# EAGLE design Application (EAGLE 7.5.0)
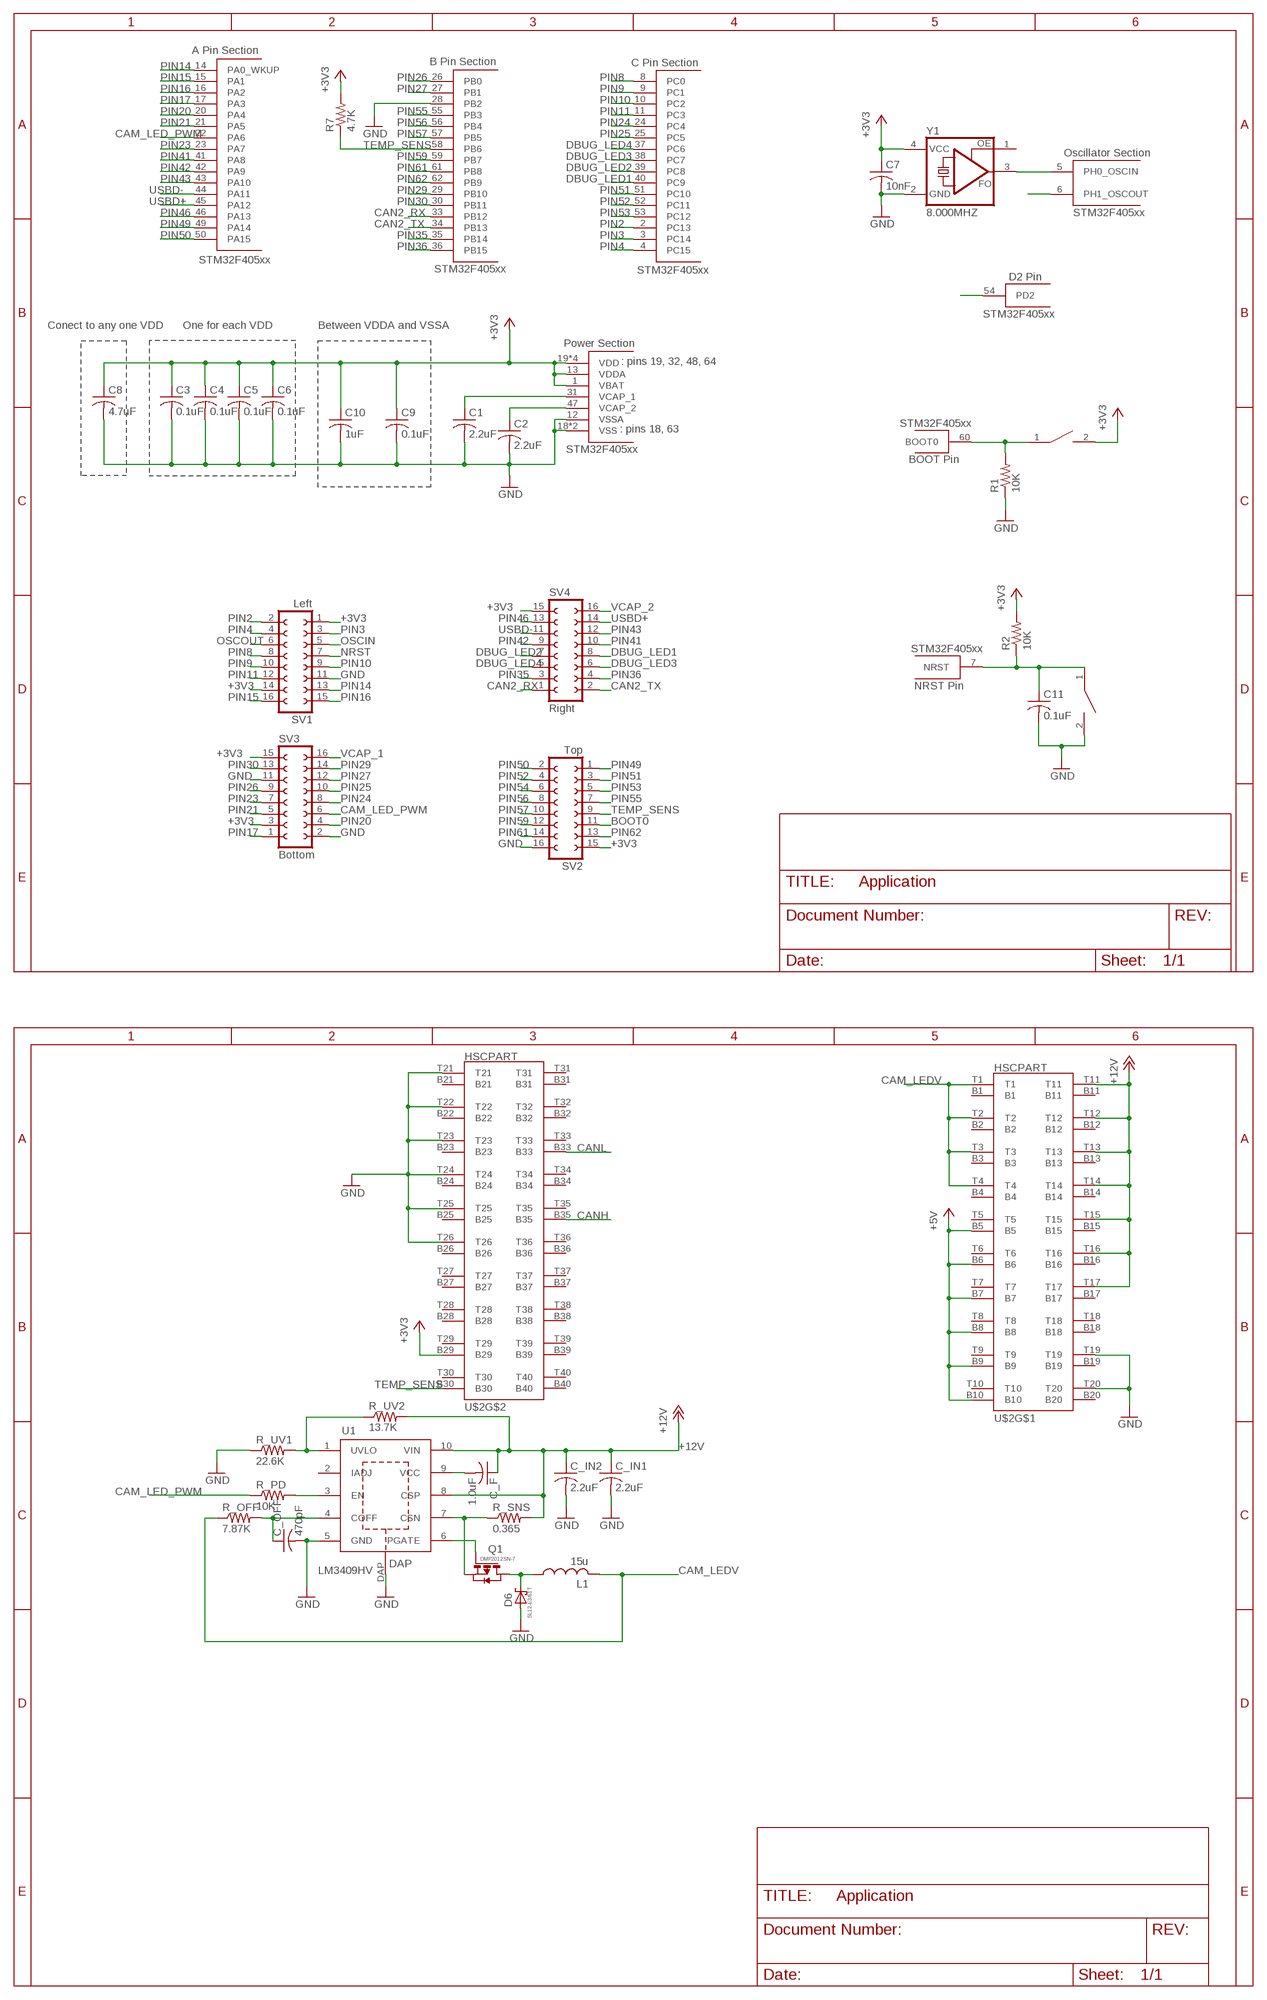
[diagram p0: schematic, sheet 1, part 1 of 2]
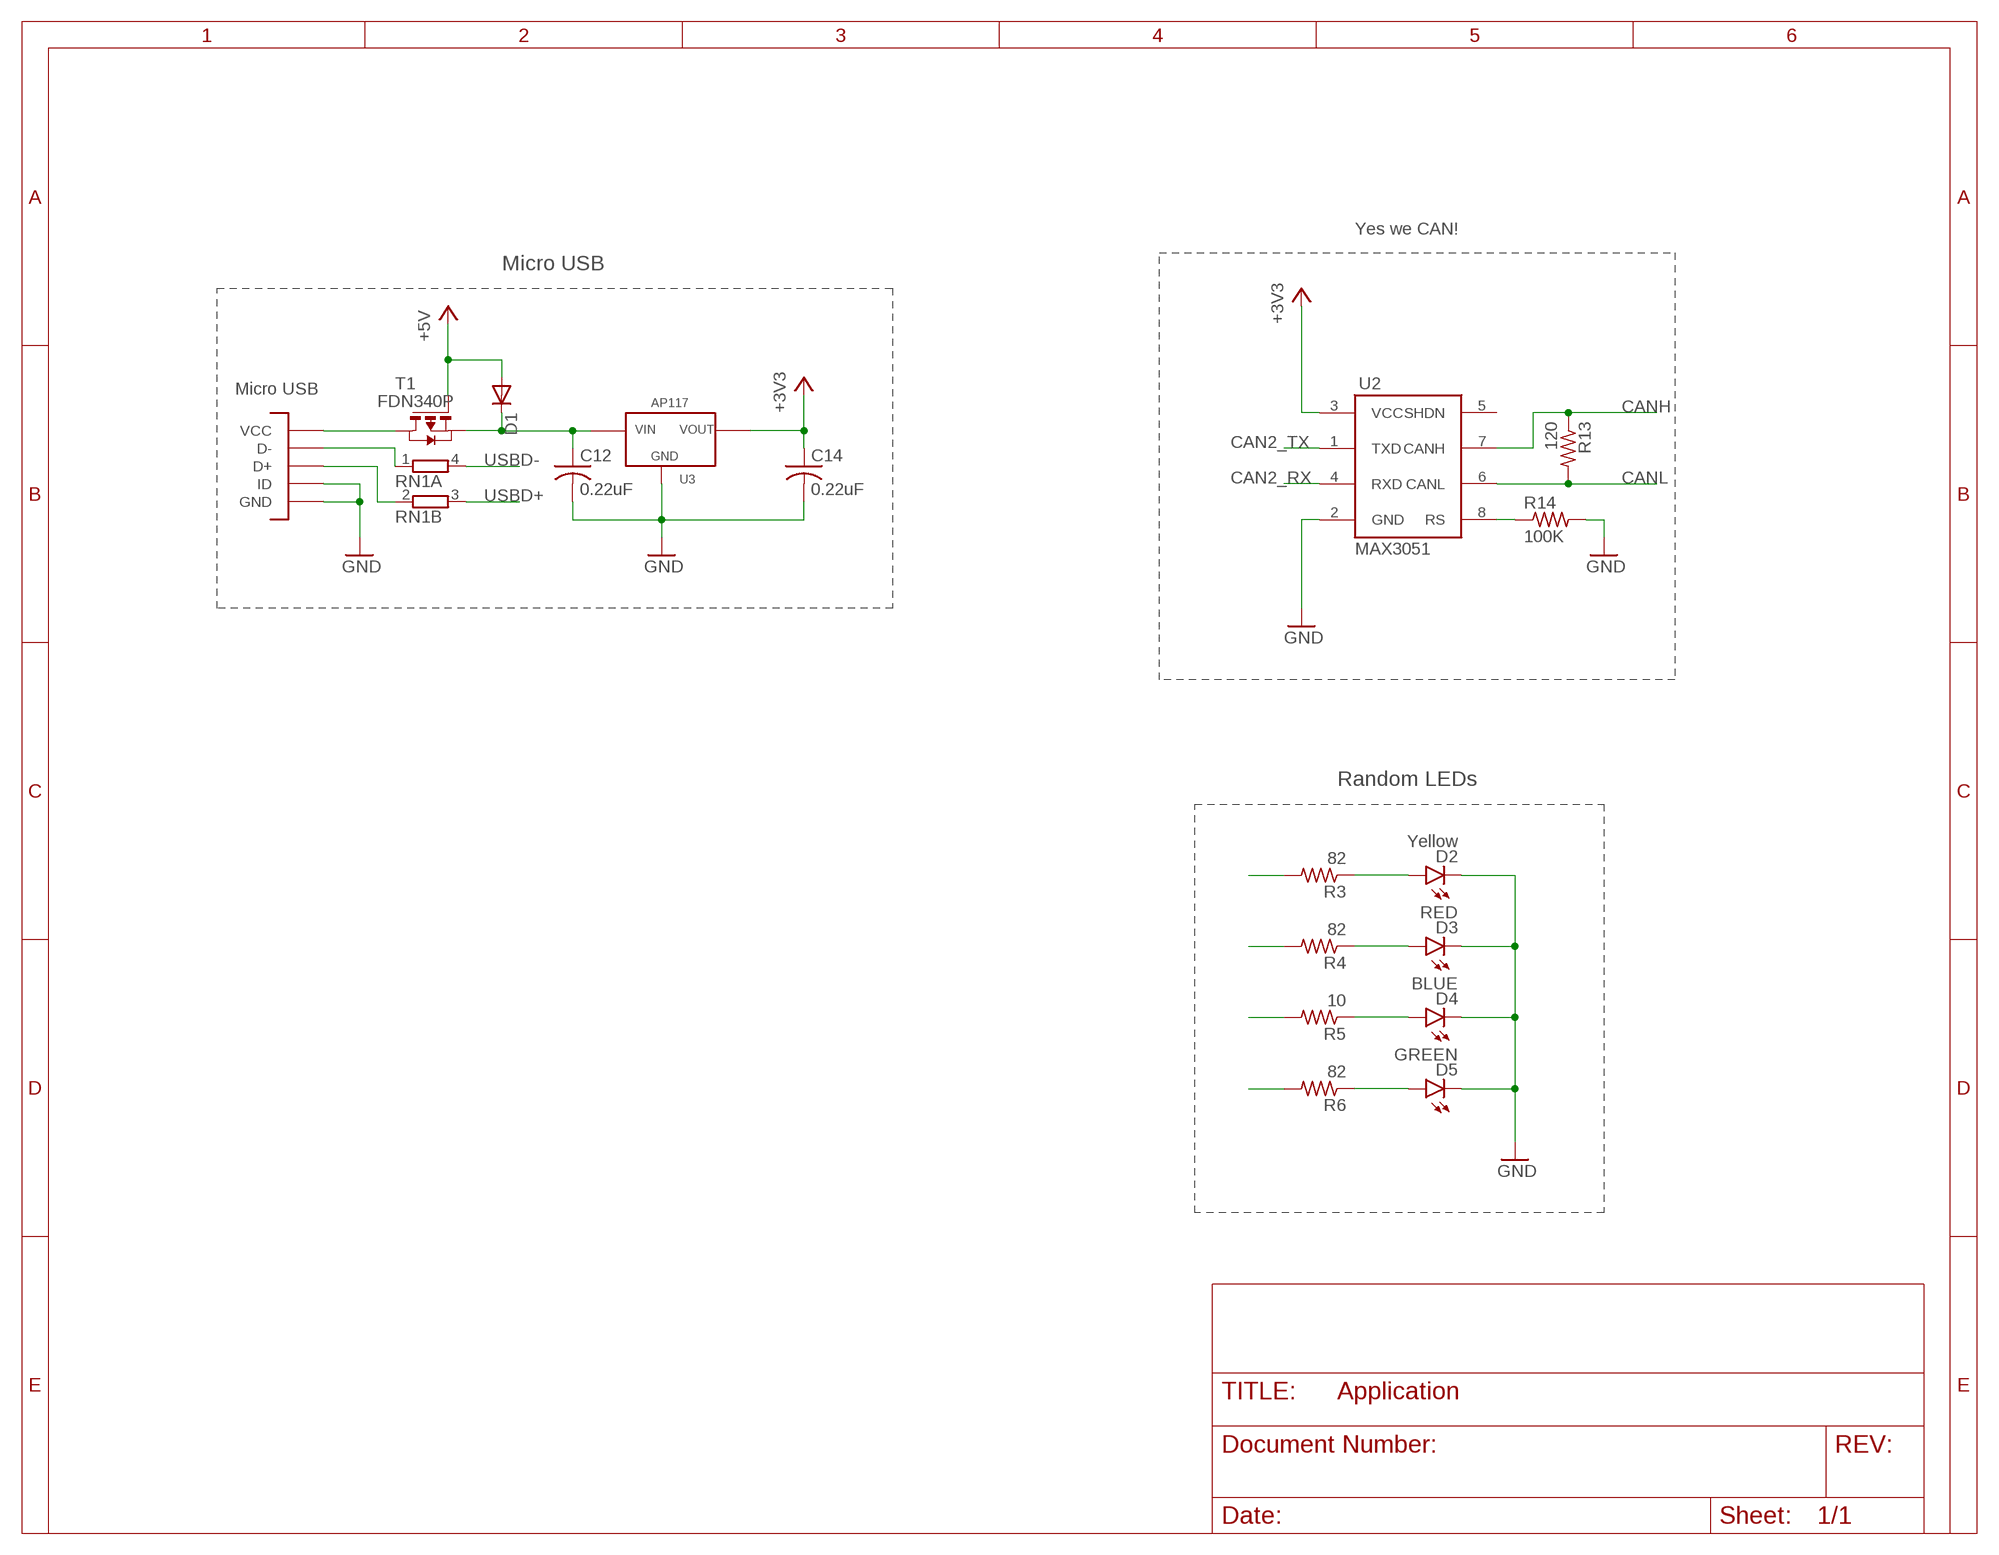
[diagram p1: schematic, sheet 1, part 2 of 2]

## Parts
C1  2.2uF  C-USC0603  [C0603]
C2  2.2uF  C-USC0603  [C0603]
C3  0.1uF  C-USC0603  [C0603]
C4  0.1uF  C-USC0603  [C0603]
C5  0.1uF  C-USC0603  [C0603]
C6  0.1uF  C-USC0603  [C0603]
C7  10nF  C-USC0603  [C0603]
C8  4.7uF  C-USC0603  [C0603]
C9  0.1uF  C-USC0603  [C0603]
C10  1uF  C-USC0603  [C0603]
C11  0.1uF  C-USC0603  [C0603]
C12  0.22uF  C-USC0603  [C0603]
C14  0.22uF  C-USC0603  [C0603]
C_F  1.0uF  C-USC0603  [C0603]
C_IN1  2.2uF  C-USC0603  [C0603]
C_IN2  2.2uF  C-USC0603  [C0603]
C_OFF  470pF  C-USC0603  [C0603]
D1  DIODE-DO-214AC  [DO-214AC]
D2  Yellow  LED-YELLOW0603  [LED-0603]
D3  RED  LED-RED0603  [LED-0603]
D4  BLUE  LED-BLUE0603  [LED-0603]
D5  GREEN  LED-GREEN0603  [LED-0603]
D6  SL12-E3/61T  [SL12-E3/61T]
L1  15u  SRN8040  [SRN8040]
Q1  DMP2012SN-7  [DMP2012SN-7]
R1  10K  R-US_R0603  [R0603]
R2  10K  R-US_R0603  [R0603]
R3  82  R-US_R0603  [R0603]
R4  82  R-US_R0603  [R0603]
R5  10  R-US_R0603  [R0603]
R6  82  R-US_R0603  [R0603]
R7  4.7K  R-US_R0603  [R0603]
R13  120  R-US_R0603  [R0603]
R14  100K  R-US_R0603  [R0603]
R_OFF  7.87K  R-US_R0603  [R0603]
R_PD  10K  R-US_R0603  [R0603]
R_SNS  0.365  R-US_R2512  [R2512]
R_UV1  22.6K  R-US_R0603  [R0603]
R_UV2  13.7K  R-US_R0603  [R0603]
RN1  2R-NEXBV4V  [EXBV4V]
S1  BOOT  SWITCH  [SW_2512]
S2  RESET  SWITCH  [SW_2512]
SV1  Left  FE08-2  [FE08-2]
SV2  Top  FE08-2  [FE08-2]
SV3  Bottom  FE08-2  [FE08-2]
SV4  Right  FE08-2  [FE08-2]
T1  FDN340P  [SOT-23]
U1  LM3409HV  LM3409HV'LM3409HV'  [VSSOP-10]
U2  MAX3051  MAX3051MAX3051  [SOT23-8L]
U3  U3  AP1117_LIN_REG  [SOT223]
U$1  STM32F405  [LQFP64]
U$2  HSCPART  [HSC8-40PINOUUT]
U$4  MICROUSB  [MICRO_B]
Y1  8.000MHZ  ASF  [ASF]

## Nets
+3V3: C3.1 C4.1 C5.1 C6.1 C7.1 C8.1 C9.1 C10.1 C14.1 R2.2 R7.2 S1.2 SV1.1 SV1.14 SV2.15 SV3.3 SV3.15 SV4.15 U2.3(VCC) U3.TAB(VOUT) U3.VOUT U$1.1(VBAT) U$1.13(VDDA) U$1.19(VDD) U$1.32(VDD) U$1.48(VDD) U$1.64(VDD) U$2.B29 Y1.4(VCC)
+5V: D1.A T1.3(G) U$2.B5 U$2.B6 U$2.B7 U$2.B8 U$2.B9 U$2.B10
+12V: C_F.1 C_IN1.1 C_IN2.1 R_SNS.2 R_UV2.2 U1.8(CSP) U1.10(VIN) U$2.T11 U$2.T12 U$2.T13 U$2.T14 U$2.T15 U$2.T16 U$2.T17
BOOT0: R1.2 S1.1 SV2.11 U$1.60(BOOT0)
CAM_LED_PWM: R_PD.1 SV3.6 U$1.22(PA6)
CAM_LEDV: L1.2 R_OFF.1 U$2.T1 U$2.T2 U$2.T3 U$2.T4
CAN2_RX: SV4.1 U2.4(RXD) U$1.33(PB12)
CAN2_TX: SV4.2 U2.1(TXD) U$1.34(PB13)
CANH: R13.1 U2.7(CANH) U$2.B35
CANL: R13.2 U2.6(CANL) U$2.B33
DBUG_LED1: R3.2 SV4.8 U$1.40(PC9)
DBUG_LED2: R4.2 SV4.7 U$1.39(PC8)
DBUG_LED3: R5.2 SV4.6 U$1.38(PC7)
DBUG_LED4: R6.2 SV4.5 U$1.37(PC6)
GND: C1.2 C2.2 C3.2 C4.2 C5.2 C6.2 C7.2 C8.2 C9.2 C10.2 C11.2 C12.2 C14.2 C_IN1.2 C_IN2.2 C_OFF.2 D2.C D3.C D4.C D5.C D6.2(A) R1.1 R14.2 R_UV1.1 S2.2 SV1.11 SV2.16 SV3.2 SV3.11 U1.5(GND) U1.DAP U2.2(GND) U3.GND U$1.12(VSSA) U$1.18(VSS) U$1.28(PB2) U$1.63(VSS) U$2.T19 U$2.T20 U$2.T21 U$2.T22 U$2.T23 U$2.T24 U$2.T25 U$2.T26 U$4.GND1(GND) U$4.GND2(GND) U$4.GND3(GND) U$4.GND4(GND) U$4.GND7(GND) U$4.GND8(GND) U$4.P4(ID) U$4.P5(GND) Y1.2(GND)
L1: D6.1(C) L1.1 Q1.1(D)
N$1: RN1.1 U$4.P2(D-)
N$5: R_UV1.2 R_UV2.1 U1.1(UVLO)
N$6: C_OFF.1 R_OFF.2 U1.4(COFF)
N$7: C_F.2 U1.9(VCC)
N$8: Q1.3(S) R_SNS.1 U1.7(CSN)
N$9: R_PD.2 U1.3(EN)
N$10: Q1.2(G) U1.6(PGATE)
N$24: RN1.2 U$4.P3(D+)
N$57: T1.1(D) U$4.P1(VCC)
N$58: C12.1 D1.C T1.2(S) U3.VIN
N$59: D2.A R3.1
N$60: D3.A R4.1
N$61: D4.A R5.1
N$62: D5.A R6.1
N$63: R14.1 U2.8(RS)
NRST: C11.1 R2.1 S2.1 SV1.7 U$1.7(NRST)
OSCIN: SV1.5 U$1.5(PH0_OSCIN) Y1.3(FO)
OSCOUT: SV1.6 U$1.6(PH1_OSCOUT)
PIN2: SV1.2 U$1.2(PC13)
PIN3: SV1.3 U$1.3(PC14)
PIN4: SV1.4 U$1.4(PC15)
PIN8: SV1.8 U$1.8(PC0)
PIN9: SV1.10 U$1.9(PC1)
PIN10: SV1.9 U$1.10(PC2)
PIN11: SV1.12 U$1.11(PC3)
PIN14: SV1.13 U$1.14(PA0_WKUP)
PIN15: SV1.16 U$1.15(PA1)
PIN16: SV1.15 U$1.16(PA2)
PIN17: SV3.1 U$1.17(PA3)
PIN20: SV3.4 U$1.20(PA4)
PIN21: SV3.5 U$1.21(PA5)
PIN23: SV3.7 U$1.23(PA7)
PIN24: SV3.8 U$1.24(PC4)
PIN25: SV3.10 U$1.25(PC5)
PIN26: SV3.9 U$1.26(PB0)
PIN27: SV3.12 U$1.27(PB1)
PIN29: SV3.14 U$1.29(PB10)
PIN30: SV3.13 U$1.30(PB11)
PIN35: SV4.3 U$1.35(PB14)
PIN36: SV4.4 U$1.36(PB15)
PIN41: SV4.10 U$1.41(PA8)
PIN42: SV4.9 U$1.42(PA9)
PIN43: SV4.12 U$1.43(PA10)
PIN46: SV4.13 U$1.46(PA13)
PIN49: SV2.1 U$1.49(PA14)
PIN50: SV2.2 U$1.50(PA15)
PIN51: SV2.3 U$1.51(PC10)
PIN52: SV2.4 U$1.52(PC11)
PIN53: SV2.5 U$1.53(PC12)
PIN54: SV2.6 U$1.54(PD2)
PIN55: SV2.7 U$1.55(PB3)
PIN56: SV2.8 U$1.56(PB4)
PIN57: SV2.10 U$1.57(PB5)
PIN59: SV2.12 U$1.59(PB7)
PIN61: SV2.14 U$1.61(PB8)
PIN62: SV2.13 U$1.62(PB9)
TEMP_SENS: R7.1 SV2.9 U$1.58(PB6) U$2.B30
USBD+: RN1.3 SV4.14 U$1.45(PA12)
USBD-: RN1.4 SV4.11 U$1.44(PA11)
VCAP_1: C1.1 SV3.16 U$1.31(VCAP_1)
VCAP_2: C2.1 SV4.16 U$1.47(VCAP_2)
Unconnected: U1.2(IADJ) U2.5(SHDN) U$2.B1 U$2.B2 U$2.B3 U$2.B4 U$2.B11 U$2.B12 U$2.B13 U$2.B14 U$2.B15 U$2.B16 U$2.B17 U$2.B18 U$2.B19 U$2.B20 U$2.B21 U$2.B22 U$2.B23 U$2.B24 U$2.B25 U$2.B26 U$2.B27 U$2.B28 U$2.B31 U$2.B32 U$2.B34 U$2.B36 U$2.B37 U$2.B38 U$2.B39 U$2.B40 U$2.T5 U$2.T6 U$2.T7 U$2.T8 U$2.T9 U$2.T10 U$2.T18 U$2.T27 U$2.T28 U$2.T29 U$2.T30 U$2.T31 U$2.T32 U$2.T33 U$2.T34 U$2.T35 U$2.T36 U$2.T37 U$2.T38 U$2.T39 U$2.T40 Y1.1(OE)

## Notes on the sheet
- Yes we CAN!
- Micro USB
- Micro USB
- Conect to any one VDD | One for each VDD | Between VDDA and VSSA
- : pins 19, 32, 48, 64
- : pins 18, 63
- Random LEDs

## Library data of the parts
C1-C12 C14 = rcl:C-US: CAPACITOR, American symbol
C_F C_IN1 C_IN2 C_OFF = resistor:C-US: CAPACITOR, American symbol
D1 = DiscreteComponents:DIODE-: DIODE
D2 = SparkFun-LED:LED-YELLOW: Yellow SMD LEDs LilyPad 1206- DIO-09909 0603- DIO-09003 "SMART" means more efficient and expensive; PROD_ID: DIO-09003
D3 = SparkFun-LED:LED-RED: Assorted Red LEDs LilyPad 1206- DIO-09912 1206- DIO-00809 0603- DIO-00819 "SMART" means more efficient and expensive; PROD_ID: DIO-00819
D4 = SparkFun-LED:LED-BLUE: Blue LEDs for production use Various blue LEDs stocked by SparkFun production 0603 - DIO-08575 Rebel - DIO-09553 1206 - DIO-09911; PROD_ID: DIO-08575
D5 = SparkFun-LED:LED-GREEN: Various green LEDs Green LEDs used in SFE Production 0603- DIO-00821 LARGE- DIO-00862 LILYPAD- DIO-09910; PROD_ID: DIO-00821
D6 = DiscreteComponents:SL12-E3/61T
L1 = DiscreteComponents:SRN8040
Q1 = DiscreteComponents:DMP2012SN-7
R1-R7 R13 R14 = rcl:R-US_: RESISTOR, American symbol
R_OFF R_PD R_SNS R_UV1 R_UV2 = DiscreteComponents:R-US_: RESISTOR, American symbol
RN1 = DiscreteComponents:2R-N: Array Chip Resistor; DIGIKEY: RHM1381CT-ND; MF: Rohm Semiconductor; MPN: MNR12ERAPJ220
S1 S2 = DiscreteComponents:SWITCH
SV1-SV4 = con-lsta:FE08-2: FEMALE HEADER; OC_FARNELL: unknown; OC_NEWARK: unknown
T1 = DiscreteComponents:FDN340P: MOS FET; DIGIKEY: FDN340PCT-ND
U1 = 2015_LED_Driver:LM3409HV
U2 = MAX3051 Library:MAX3051: Maxim Integrated MAX3051 CAN Tranciever
U3 = PowerComponents:AP1117_LIN_REG
U$1 = Other:STM32F405
U$2 = Connectors:HSCPART
U$4 = Other:MICROUSB
Y1 = DiscreteComponents:ASF*: CRYSTAL CLOCK OSCILLATORS 5.0 Vdc or 3.3 Vdc - LOW PROFILE ULTRA MINIATURE CERAMIC SURFACE MOUNT Source: http://www.abracon.com/Oscillators/asf1-L-L1.pdf; DIGIKEY: 535-10066-1-ND

## Board
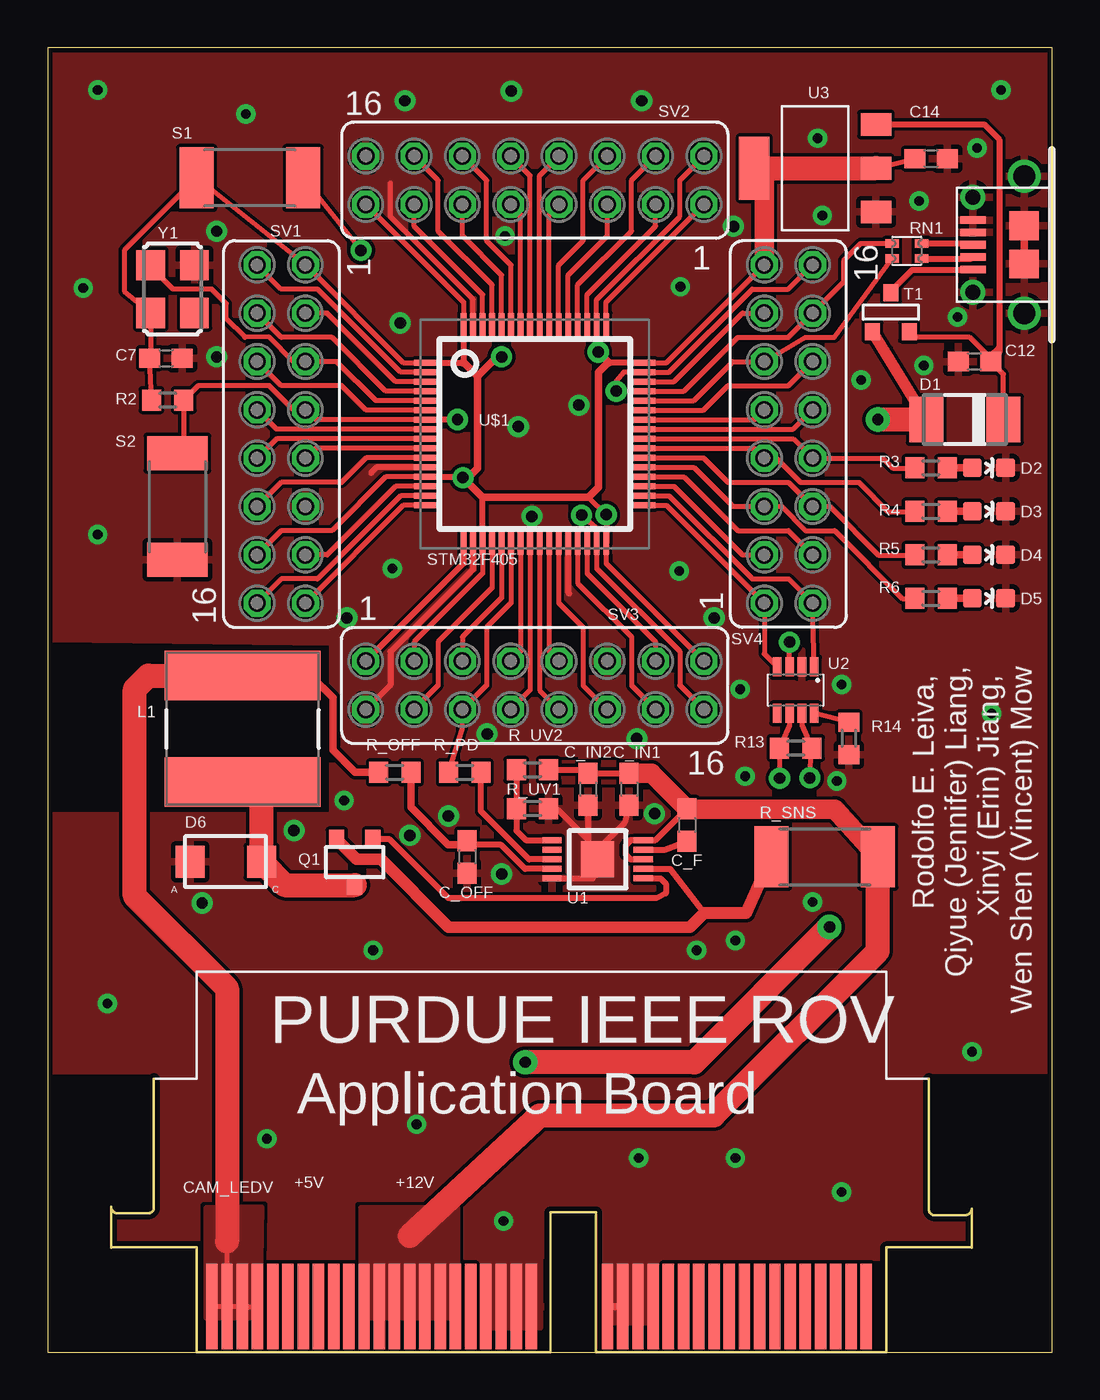
[diagram p2: board, top side]
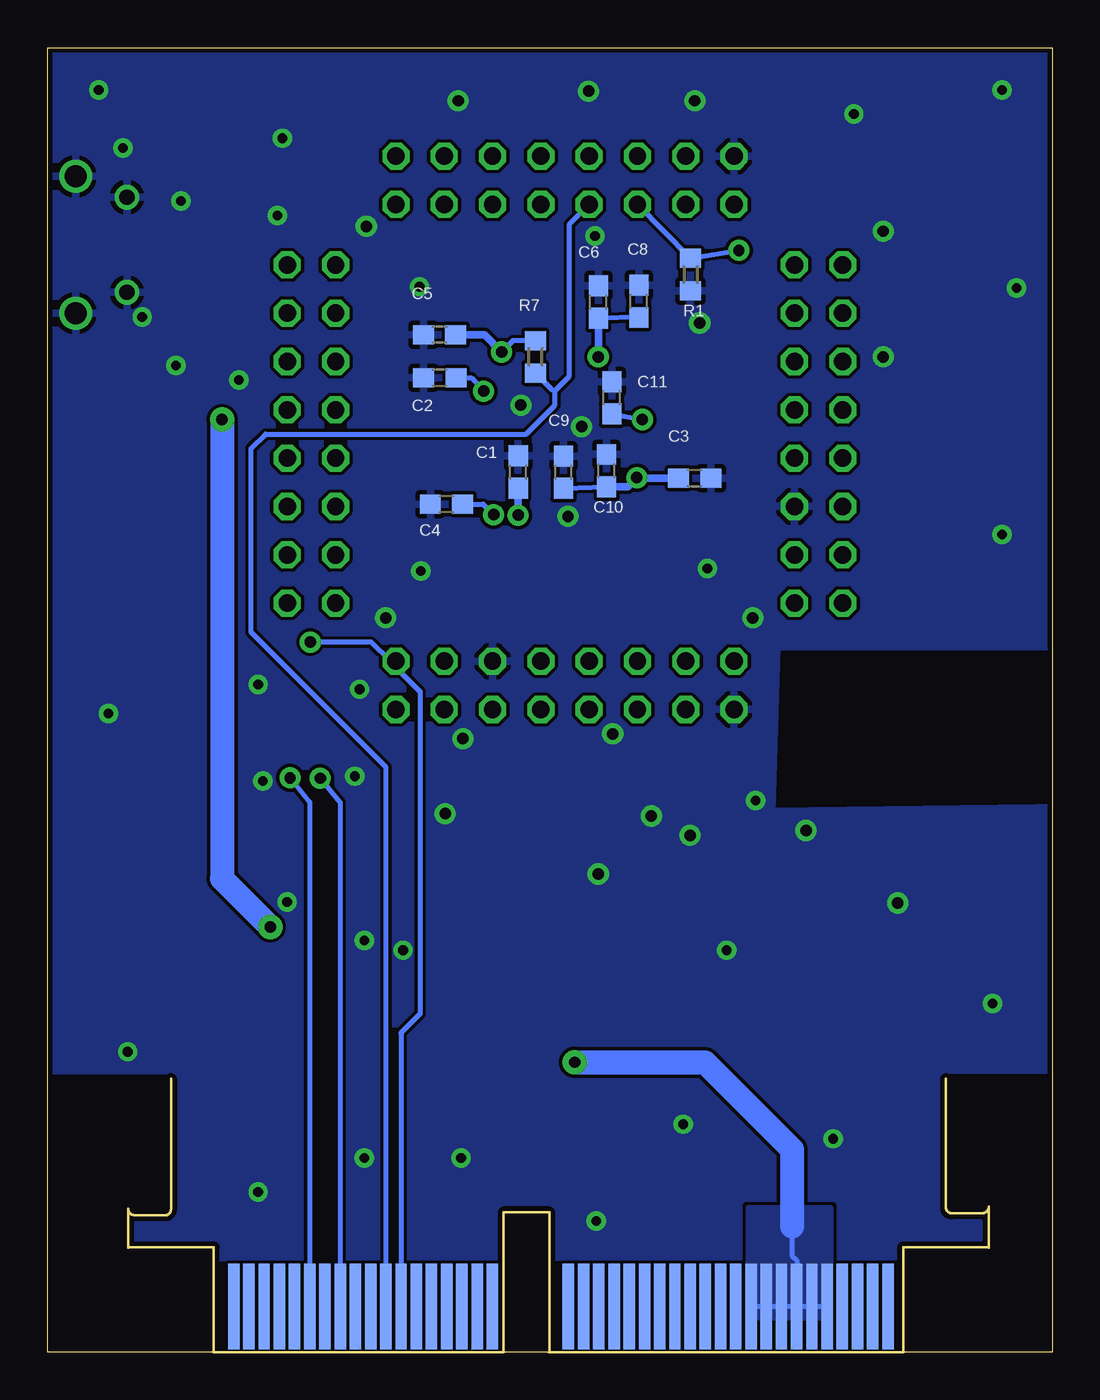
[diagram p3: board, bottom side, seen from below]

Size 52.83 x 68.58 mm. Coordinates in mm from the lower left corner, seen from the top.
Outline: 0,0 52.83,0 52.83,68.58 0,68.58 0,0
Copper layers (1*16): Top 0.035mm / dielectric 1.5mm / Bottom 0.035mm
Design rules "GoldPhoenix": minimum track width 7mil, minimum drill 10mil, track to track 7mil, track to pad 7mil, pad to pad 7mil, via to via 7mil, smd to smd 7mil, copper to edge 10mil, drill to drill 8mil, minimum pad ring 10mil, minimum via ring 10mil, stop-mask expansion 4mil, vias tented up to drill 25mil, thermal gap 10mil

### Footprints (pad centres in the part's own frame; a part is rotated, then mirrored left to right if it is on the bottom)
C0603 = smd 1.1 x 1: 1 -0.85,0; 2 0.85,0
DO-214AC = smd 1.8 x 2.4: A 2.025,0; C -2.025,0
LED-0603 = smd 1 x 1: A 0,-0.877; C 0,0.877
SL12-E3/61T = smd 1.524 x 1.676: 1 -1.88,0; 2 1.88,0
SRN8040 = smd 2.6 x 8.2: 1 -2.8,0; 2 2.8,0
DMP2012SN-7 = smd 0.8 x 1: 1 0,1.2; 2 -0.95,-1.2; 3 0.95,-1.2
R0603 = smd 1 x 1.1: 1 -0.85,0; 2 0.85,0
R2512 = smd 1.8 x 3.2: 1 -2.8,0; 2 2.8,0
EXBV4V = smd 0.45 x 0.7: 1 -0.4,-0.775; 2 0.4,-0.775; 3 0.4,0.775; 4 -0.4,0.775
SW_2512 = smd 1.8 x 3.2: 1 -2.8,0; 2 2.8,0
FE08-2 = drill 0.914 octagon: 1 -8.89,1.27; 2 -8.89,-1.27; 3 -6.35,1.27; 4 -6.35,-1.27; 5 -3.81,1.27; 6 -3.81,-1.27; 7 -1.27,1.27; 8 -1.27,-1.27; 9 1.27,1.27; 10 1.27,-1.27; 11 3.81,1.27; 12 3.81,-1.27; 13 6.35,1.27; 14 6.35,-1.27; 15 8.89,1.27; 16 8.89,-1.27
SOT-23 = smd 0.787 x 0.889: 1 0.025,-1.016; 2 -0.94,1.016; 3 0.991,1.016
VSSOP-10 = smd 0.305 x 1.016: 1 -1.001,-2.4; 2 -0.5,-2.4; 3 0,-2.4; 4 0.5,-2.4; 5 1.001,-2.4; 6 1.001,2.4; 7 0.5,2.4; 8 0,2.4; 9 -0.5,2.4; 10 -1.001,2.4 | smd 1.905 x 1.727: DAP 0,0
SOT23-8L = smd 0.45 x 1: 1 -0.975,-1.225; 2 -0.325,-1.225; 3 0.325,-1.225; 4 0.975,-1.225; 5 0.975,1.225; 6 0.325,1.225; 7 -0.325,1.225; 8 -0.975,1.225
SOT223 = smd 1.2 x 1.6: GND -2.3,-3.2; VIN 2.3,-3.2; VOUT 0,-3.2 | smd 3.3 x 1.6: TAB 0,3.2
LQFP64 = smd 1.2 x 0.3: 1 -5.75,3.75; 2 -5.75,3.25; 3 -5.75,2.75; 4 -5.75,2.25; 5 -5.75,1.75; 6 -5.75,1.25; 7 -5.75,0.75; 8 -5.75,0.25; 9 -5.75,-0.25; 10 -5.75,-0.75; 11 -5.75,-1.25; 12 -5.75,-1.75; 13 -5.75,-2.25; 14 -5.75,-2.75; 15 -5.75,-3.25; 16 -5.75,-3.75; 33 5.75,-3.75; 34 5.75,-3.25; 35 5.75,-2.75; 36 5.75,-2.25; 37 5.75,-1.75; 38 5.75,-1.25; 39 5.75,-0.75; 40 5.75,-0.25; 41 5.75,0.25; 42 5.75,0.75; 43 5.75,1.25; 44 5.75,1.75; 45 5.75,2.25; 46 5.75,2.75; 47 5.75,3.25; 48 5.75,3.75 | smd 0.3 x 1.2: 17 -3.75,-5.75; 18 -3.25,-5.75; 19 -2.75,-5.75; 20 -2.25,-5.75; 21 -1.75,-5.75; 22 -1.25,-5.75; 23 -0.75,-5.75; 24 -0.25,-5.75; 25 0.25,-5.75; 26 0.75,-5.75; 27 1.25,-5.75; 28 1.75,-5.75; 29 2.25,-5.75; 30 2.75,-5.75; 31 3.25,-5.75; 32 3.75,-5.75; 49 3.75,5.75; 50 3.25,5.75; 51 2.75,5.75; 52 2.25,5.75; 53 1.75,5.75; 54 1.25,5.75; 55 0.75,5.75; 56 0.25,5.75; 57 -0.25,5.75; 58 -0.75,5.75; 59 -1.25,5.75; 60 -1.75,5.75; 61 -2.25,5.75; 62 -2.75,5.75; 63 -3.25,5.75; 64 -3.75,5.75
HSC8-40PINOUUT = smd 0.6 x 4.5 bottom: B1 0.8,2.4; B2 1.6,2.4; B3 2.4,2.4; B4 3.2,2.4; B5 4,2.4; B6 4.8,2.4; B7 5.6,2.4; B8 6.4,2.4; B9 7.2,2.4; B10 8,2.4; B11 8.8,2.4; B12 9.6,2.4; B13 10.4,2.4; B14 11.2,2.4; B15 12,2.4; B16 12.8,2.4; B17 13.6,2.4; B18 14.4,2.4; B19 15.2,2.4; B20 16,2.4; B21 16.8,2.4; B22 17.6,2.4; B23 21.6,2.4; B24 22.4,2.4; B25 23.2,2.4; B26 24,2.4; B27 24.8,2.4; B28 25.6,2.4; B29 26.4,2.4; B30 27.2,2.4; B31 28,2.4; B32 28.8,2.4; B33 29.6,2.4; B34 30.4,2.4; B35 31.2,2.4; B36 32,2.4; B37 32.8,2.4; B38 33.6,2.4; B39 34.4,2.4; B40 35.2,2.4 | smd 0.6 x 4.5: T1 0.8,2.4; T2 1.6,2.4; T3 2.4,2.4; T4 3.2,2.4; T5 4,2.4; T6 4.8,2.4; T7 5.6,2.4; T8 6.4,2.4; T9 7.2,2.4; T10 8,2.4; T11 8.8,2.4; T12 9.6,2.4; T13 10.4,2.4; T14 11.2,2.4; T15 12,2.4; T16 12.8,2.4; T17 13.6,2.4; T18 14.4,2.4; T19 15.2,2.4; T20 16,2.4; T21 16.8,2.4; T22 17.6,2.4; T23 21.6,2.4; T24 22.4,2.4; T25 23.2,2.4; T26 24,2.4; T27 24.8,2.4; T28 25.6,2.4; T29 26.4,2.4; T30 27.2,2.4; T31 28,2.4; T32 28.8,2.4; T33 29.6,2.4; T34 30.4,2.4; T35 31.2,2.4; T36 32,2.4; T37 32.8,2.4; T38 33.6,2.4; T39 34.4,2.4; T40 35.2,2.4
MICRO_B = smd 1.5 x 1.55: GND1 -1,1.45; GND2 1,1.45 | drill 0.8: GND3 -2.5,4.15; GND4 2.5,4.15 | drill 1.15: GND7 -3.598,1.45; GND8 3.598,1.45 | smd 0.4 x 1.35: P1 -1.3,4.15; P2 -0.65,4.15; P3 0,4.15; P4 0.65,4.15; P5 1.3,4.15
ASF = smd 1.6 x 1.5: 1 -1.25,-1.15; 2 1.25,-1.15; 3 1.25,1.15; 4 -1.25,1.15

### Placement (x,y rotation side)
C1  28.08,46.27 90 bottom
C2  32.21,51.22 180 bottom
C3  18.81,45.95 0 bottom
C4  31.86,44.59 180 bottom
C5  32.22,53.49 180 bottom
C6  23.87,55.2 90 bottom
C7  6.23,52.25 0 top
C8  21.74,55.24 90 bottom
C9  25.7,46.26 90 bottom
C10  23.43,46.34 90 bottom
C11  23.16,50.18 90 bottom
C12  48.74,52.08 180 top
C14  46.45,62.75 0 top
C_F  33.62,27.72 270 top
C_IN1  30.58,29.6 270 top
C_IN2  28.42,29.6 270 top
C_OFF  22.07,26.05 270 top
D1  48.23,49.03 180 top
D2  49.5,46.49 270 top
D3  49.5,44.21 270 top
D4  49.5,41.92 270 top
D5  49.5,39.63 270 top
D6  9.37,25.79 180 top
L1  10.26,32.78 90 top
Q1  16.15,25.77 180 top
R1  19.02,56.65 90 bottom
R2  6.32,50.05 180 top
R3  46.45,46.49 180 top
R4  46.45,44.21 180 top
R5  46.45,41.92 180 top
R6  46.45,39.63 180 top
R7  27.18,52.32 90 bottom
R13  39.34,31.76 180 top
R14  42.13,32.27 270 top
R_OFF  18.26,30.49 0 top
R_PD  21.94,30.49 0 top
R_SNS  40.86,26.05 0 top
R_UV1  25.5,28.59 180 top
R_UV2  25.5,30.62 0 top
RN1  45.18,57.89 90 top
S1  10.64,61.73 180 top
S2  6.83,44.46 270 top
SV1  12.29,48.27 270 top
SV2  25.62,61.61 180 top
SV3  25.62,35.06 0 top
SV4  38.96,48.27 90 top
T1  44.37,54.67 180 top
U1  28.93,25.92 270 top
U2  39.34,34.81 180 top
U3  40.36,62.24 90 top
U$1  25.62,48.27 0 top
U$2  7.84,0.01 0 top
U$4  52.81,58.21 90 top
Y1  6.57,55.89 90 top

### Tracks (layer width: path | path; a pad name or v marks a point on that pad's centre or on a via)
12V
  pour Top: 31.35,31 26.89,31 25.88,29.98 31.47,29.98
+3V3  (via drill 0.6, 0.6 pad 0.3)
  Top 0.254: SV3.15 29.37,41.47 U$1.32 | U$1.48 32.55,52.02 SV4.15 | SV2.15 21.87,55.2 U$1.64 | U$1.1 18.7,52.02 SV1.1 S1.2 4.03,57.92 4.03,55.78 Y1.4 5.42,52.46 C7.1 R2.2 | U$1.13 17.79,46.02 14.96,43.19 12.29,43.19 SV1.14 | U$1.19 22.87,40.95 19.27,37.35 SV3.3 | U2.3 v39.01,37.34 | 42.77,62.24 U3.VOUT C14.1 | 28.45,44.96 v29.38,44.03
  Top 0.305: U$1.64 21.87,52.07 | U$1.1 21.82,52.02 | U$1.19 22.87,44.94 | U$1.13 21.8,46.02 | 29.41,52.02 29.46,52.02 U$1.48 29.51,52.02 | v29.38,44.03 U$1.32
  Top 0.406: 22.61,51.31 21.87,52.04 21.87,52.07 21.82,52.02 | 22.61,51.31 22.61,46.48 22.1,45.97 v21.84,45.97 | v21.84,45.97 22.87,44.94 28.19,44.96 28.45,44.96 28.96,45.47 28.96,51.51 29.46,52.02 | 21.8,46.02 v21.84,45.97 | 29.51,52.02 v28.96,52.58 | v23.88,52.32 23.62,52.32 22.61,51.31
  Top 1.016: SV4.15 37.69,61.71 U3.TAB
  Top 1.27: U3.TAB U3.VOUT
  Bottom 0.254: C9.1 C10.1 | C8.1 C6.1 | U$2.B29 34.24,16.79 33.24,17.79 33.24,34.73 34.68,36.17 SV3.15 34.81,36.33 35.81,37.34 38.78,37.34 v39.01,37.34 | 28.79,52.74 v28.96,52.58 28.36,53.17 R7.2 | C4.1 29.93,44.59 v29.38,44.03
  Bottom 0.406: C3.1 21.82,45.95 v21.84,45.97 22.32,45.49 C10.1 | C5.1 29.86,53.49 v28.96,52.58 | C6.1 23.88,53.08 v23.88,52.32
+5V  (via drill 0.6 pad 1.27)
  Top 0.406: T1.3 43.4,53.35
  Top 0.61: T1.3 D1.A
  Top 1.27: D1.A v43.66,49.03 | v41.12,22.36 34.01,15.25 v25.12,15.25
  Bottom 0.254: U$2.B7 13.43,2.42 13.43,4.84 13.69,5.09 13.69,6.61 | U$2.B5 U$2.B6 U$2.B7 | U$2.B7 U$2.B8 U$2.B9 U$2.B10
  Bottom 1.27: v43.66,49.03 43.66,24.9 v41.12,22.36 | v25.12,15.25 18.26,15.25 13.69,10.68 13.69,6.61
  pour Bottom (no thermals): 15.97,7.63 11.65,7.63 11.65,1.79 15.97,1.79
+12V
  Top 0.305: R_UV2.2 28.51,30.62 C_IN2.1 C_IN1.1 | C_F.1 31.97,26.92 U1.10 30.66,26.92 30.39,26.64 30.39,26.18 30.65,25.92 U1.8 31.32,25.91
  Top 0.406: C_IN1.1 30.32,30.49
  Top 0.635: C_F.1 33.7,28.56 33.65,28.79
  Top 1.016: C_IN1.1 31.75,30.45 C_F.1 | 43.43,26.53 R_SNS.2 41.4,28.56 33.7,28.56
  Top 1.27: 19.04,6.13 25.88,12.46 35.02,12.46 43.66,21.09 43.66,26.29 R_SNS.2
  pour Top (no thermals): 21.56,1.79 16.48,1.79 16.48,7.63 21.56,7.63
BOOT0  (via drill 0.6)
  Top 0.254: U$1.60 23.87,56.62 21.81,58.68 SV2.11 | v16.48,57.92 S1.1
  Bottom 0.254: SV2.11 R1.2 v16.48,57.92
CAM_LED_PWM
  Top 0.254: U$1.22 24.37,39.4 23.08,38.11 23.08,35.06 SV3.6 21.81,32.81 R_PD.1
CAM_LEDV
  Top 0.254: 9.41,7.76 9.34,6.13 9.44,6.03 9.44,5.84 U$2.T2 | U$2.T2 U$2.T3 U$2.T4 | U$2.T2 U$2.T1
  Top 0.406: R_OFF.1 16.18,30.49 15.01,31.66 15.01,34.4 13.86,35.55 10.29,35.55 L1.2
  Top 1.27: L1.2 5.3,35.57 4.59,34.86 4.59,23.99 9.44,19.14 9.44,5.84
  pour Top (no thermals): 8.35,7.63 11.25,7.67 11.15,1.79 8.35,1.79
CAN2_RX
  Top 0.254: U$1.33 32.55,44.52 SV4.1 37.69,36.71 U2.4
CAN2_TX
  Top 0.254: U$1.34 32.68,45.02 37.05,40.65 38.96,40.65 SV4.2 U2.1
CANH  (via drill 0.6)
  Top 0.254: U2.7 39.66,32.96 R13.1 40.1,31.67 v40.08,30.2
  Bottom 0.254: v40.08,30.2 39.04,28.92 U$2.B35
CANL  (via drill 0.6)
  Top 0.254: U2.6 39.02,32.96 R13.2 38.49,29.95 v38.5,30.18
  Bottom 0.254: v38.5,30.18 37.44,28.9 U$2.B33
DBUG_LED1
  Top 0.254: U$1.40 39.21,48.02 SV4.8 43.93,47 44.45,46.48 R3.2
DBUG_LED2
  Top 0.254: U$1.39 37.17,47.52 SV4.7 38.32,47 39.59,45.73 42.66,45.73 44.2,44.2 45.59,44.2 R4.2
DBUG_LED3
  Top 0.254: U$1.38 34.49,47.02 35.78,45.73 38.96,45.73 SV4.6 41.14,44.46 43.69,41.91 R5.2
DBUG_LED4
  Top 0.254: U$1.37 33.98,46.52 36.04,44.46 SV4.5 38.58,44.46 39.85,43.19 41.39,43.19 44.96,39.62 R6.2
GND  (via drill 0.51, 0.51 pad 0.3, 0.6)
  Top 0.254: U$1.63 22.37,55.35 18.03,59.69 18.03,61.47
  Top 0.305: U1.5 28.66,24.92 28.93,25.16 | R_UV1.1 26.86,28.5 28.42,26.93 C_IN2.2 | C_IN1.2 30.32,27.82 28.93,26.43 | U$1.18 22.37,41.17 18.03,36.83 18.03,35.09 SV3.2 | U$1.28 27.37,39.94 27.43,39.88 | U$1.12 17.31,46.52 17.02,46.23
  Top 0.406: 50.26,39.52 D5.C | U$4.GND2 U$4.GND1 | U$2.T24 U$2.T23
  other vias: 10.43,65.09 33.21,41.06 24.05,58.68 24.75,48.65 33.28,56.01 18.13,41.2 2.64,66.35 3.15,18.34 48.61,15.8 50.14,66.35 40.74,59.75 1.88,55.94 45.82,60.51 47.85,54.41 46.07,51.87 48.87,63.3 40.49,63.81 42.77,51.11 49.63,33.58 41.76,35.11 36.42,34.85 41.5,30.03 36.68,30.28 36.17,21.65 40.23,23.68 34.14,21.14 17.12,21.14 19.4,11.99 31.09,10.22 36.17,10.22 11.53,11.23 23.98,6.91 41.76,8.44 15.59,29.01 35.05,38.61 12.95,27.43 8.13,23.62 18.8,65.79 31.24,65.79 18.54,54.1 19.05,27.18 23.88,25.15 25.47,43.94 36.07,59.18 24.38,66.29 15.75,38.61 31.92,28.32 30.99,32.26 27.94,49.78 23.11,32.51 21.08,28.19 8.89,58.93 8.89,52.32 2.64,42.98
  pour Top (no thermals): 27.85,24.52 27.85,27.32 30.04,27.34 30.04,24.55
  pour Top (rank 6): -5.59,69.09 -6.1,37.59 14.99,37.34 14.99,28.19 -4.57,28.19 -4.57,-2.29 56.39,-2.03 56.64,69.09
  pour Bottom (rank 6): -6.35,69.34 -6.6,37.08 14.48,37.08 14.73,28.45 -5.08,28.7 -5.08,-2.54 56.64,-2.29 57.15,69.6
  pour Top (no thermals): 22.61,1.27 22.61,5.59 25.91,5.59 25.91,1.27
  pour Top (no thermals): 29.21,5.08 32.26,5.08 32.26,1.52 29.21,1.52
L1
  Top 0.635: 10.61,29.63 L1.1
  Top 0.813: 11.25,29.79 11.43,29.97 10.95,29.97 10.61,29.63
  Top 1.27: 11.25,29.79 D6.1 12.47,24.57 Q1.1
N$1
  Top 0.305: RN1.1 48.58,57.49 U$4.P2
N$5
  Top 0.305: R_UV2.1 R_UV1.2 24.65,27.42 25.15,26.92 U1.1 26.51,26.93
N$6
  Top 0.305: U1.4 25.11,25.42 23.85,26.68 22.08,26.68 C_OFF.1
  Top 0.406: 22.08,26.68 21.07,26.68 19.11,28.64 R_OFF.2
N$7
  Top 0.305: U1.9 32.44,26.42 C_F.2
N$8
  Top 0.305: U1.7 32.73,25.42 34.51,23.1
  Top 0.61: 34.51,23.1 34.51,23.08 33.78,22.35 21.08,22.35 17.53,25.91 16.26,25.91 Q1.3
  Top 0.635: 34.51,23.1 36.74,23.1 R_SNS.1
N$9
  Top 0.305: U1.3 25.32,25.92 22.79,28.45 R_PD.2
N$10
  Top 0.305: U1.6 32.23,24.92 32.51,24.64 32.51,24.13 32,23.88 21.08,23.88 17.99,26.97 Q1.2
N$22
  cutout Top: 5.59,14.48 5.59,7.62 arc-90 5.33,7.37 3.56,7.37 arc-90 3.3,7.62 3.3,5.59 7.87,5.59 7.87,-0.25 0,-0.25 0,14.48
N$24
  Top 0.305: RN1.2 48.58,58.29 U$4.P3
N$26
  cutout Bottom: 5.59,14.48 5.59,7.62 arc-90 5.33,7.37 3.56,7.37 arc-90 3.3,7.62 3.3,5.59 7.87,5.59 7.87,-0.25 0,-0.25 0,14.48
N$27
  cutout Bottom: 46.48,14.48 46.48,7.62 arc90 46.74,7.37 48.26,7.37 arc90 48.51,7.62 48.51,5.59 44.2,5.59 44.2,-0.25 53.09,-0.25 53.09,14.48
N$28
  cutout Top: 46.48,14.48 46.48,7.62 arc90 46.74,7.37 48.26,7.37 arc90 48.51,7.62 48.51,5.59 44.2,5.59 44.2,-0.25 53.09,-0.25 53.09,14.48
N$57
  Top 0.305: T1.1 44.34,55.77 45.47,56.9 48.64,56.9 U$4.P1
N$58
  Top 0.254: D1.C 50.26,51.41 C12.1 49.59,52.25 48.48,53.35 45.61,53.35 T1.2 | 50.04,52.83 49.53,52.32
  Top 0.305: U3.VIN 49.25,64.54 50.04,63.75 50.04,52.83 50.04,52.53 C12.1
N$59
  Top 0.406: D2.A R3.1
N$60
  Top 0.406: D3.A R4.1
N$61
  Top 0.406: D4.A R5.1
N$62
  Top 0.406: D5.A R6.1
N$63
  Top 0.254: R14.1 U2.8
NRST  (via drill 0.6)
  Top 0.254: 20.29,49.03 U$1.7 14.08,49.02 SV1.7 12.92,49.54 11.65,50.81 7.93,50.81 R2.1 7.17,47.6 S2.1
  Top 0.305: v21.56,49.03 20.29,49.03
  Bottom 0.254: C11.1 v21.56,49.03
OSCIN
  Top 0.254: U$1.5 17.27,50.02 15.21,52.08 SV1.5 12.92,52.08 11.63,53.37 10.38,53.35 9.4,54.34 9.4,55.12 8.64,55.88 6.6,55.88 5.42,57.06 Y1.3
OSCOUT
  Top 0.254: U$1.6 16.75,49.52 15.46,50.81 12.29,50.81 SV1.6
PIN2
  Top 0.254: U$1.2 18.56,51.52 14.19,55.89 12.29,55.89 SV1.2
PIN3
  Top 0.254: U$1.3 18.3,51.02 14.7,54.62 SV1.3
PIN4
  Top 0.254: U$1.4 17.79,50.52 14.96,53.35 12.29,53.35 SV1.4
PIN8
  Top 0.254: U$1.8 12.04,48.52 SV1.8
PIN9
  Top 0.254: U$1.9 12.04,48.02 SV1.10
PIN10
  Top 0.254: U$1.10 14.08,47.52 SV1.9
PIN11
  Top 0.254: U$1.11 16.75,47.02 15.46,45.73 12.29,45.73 SV1.12
PIN14
  Top 0.254: U$1.14 18.3,45.52 14.7,41.92 SV1.13
PIN15
  Top 0.254: U$1.15 18.56,45.02 14.19,40.65 12.29,40.65 SV1.16
PIN16
  Top 0.254: U$1.16 18.7,44.52 SV1.15
PIN17
  Top 0.305: U$1.17 21.87,41.47 SV3.1
PIN20
  Top 0.254: U$1.20 23.37,40.18 20.54,37.35 20.54,35.06 SV3.4
PIN21
  Top 0.254: U$1.21 23.87,39.66 21.81,37.6 SV3.5
PIN23
  Top 0.254: U$1.23 24.87,36.85 SV3.7
PIN24
  Top 0.254: U$1.24 25.37,34.81 SV3.8
PIN25
  Top 0.254: U$1.25 25.87,34.81 SV3.10
PIN26
  Top 0.254: U$1.26 26.37,36.85 SV3.9
PIN27
  Top 0.254: U$1.27 26.87,39.4 28.16,38.11 28.16,35.06 SV3.12
PIN29
  Top 0.254: U$1.29 27.87,40.43 30.7,37.6 30.7,35.06 SV3.14
PIN30
  Top 0.254: U$1.30 28.37,40.95 31.97,37.35 SV3.13
PIN35
  Top 0.254: U$1.35 32.95,45.52 36.55,41.92 SV4.3
PIN36
  Top 0.254: U$1.36 33.46,46.02 36.29,43.19 38.96,43.19 SV4.4
PIN41
  Top 0.254: U$1.41 39.21,48.52 SV4.10
PIN42
  Top 0.254: U$1.42 37.17,49.02 SV4.9
PIN43
  Top 0.254: U$1.43 34.49,49.52 35.78,50.81 38.96,50.81 SV4.12
PIN46
  Top 0.254: U$1.46 32.95,51.02 36.55,54.62 SV4.13
PIN49
  Top 0.254: U$1.49 29.37,55.2 SV2.1
PIN50
  Top 0.254: U$1.50 28.87,55.33 33.24,59.7 33.24,61.6 SV2.2
PIN51
  Top 0.254: U$1.51 28.37,55.59 31.97,59.19 SV2.3
PIN52
  Top 0.254: U$1.52 27.87,56.11 30.7,58.94 30.7,61.6 SV2.4
PIN53
  Top 0.254: U$1.53 27.37,56.62 29.43,58.68 SV2.5
PIN54
  Top 0.254: U$1.54 26.87,57.14 28.16,58.43 28.16,61.6 SV2.6
PIN55
  Top 0.254: U$1.55 26.37,59.81 SV2.7
PIN56
  Top 0.254: U$1.56 25.87,61.85 SV2.8
PIN57
  Top 0.254: U$1.57 25.37,61.85 SV2.10
PIN59
  Top 0.254: U$1.59 24.37,57.14 23.08,58.43 23.08,61.6 SV2.12
PIN61
  Top 0.254: U$1.61 23.37,56.11 20.54,58.94 20.54,61.6 SV2.14
PIN62
  Top 0.254: U$1.62 22.87,55.59 19.27,59.19 SV2.13
TEMP_SENS
  Top 0.254: U$1.58 24.87,59.81 SV2.9
  Bottom 0.254: U$2.B30 35.04,30.77 42.13,37.86 42.13,47.51 41.37,48.27 27.68,48.27 26.16,49.78 26.16,50.55 | 24.61,60.08 SV2.9 25.4,59.29 25.4,51.31 26.16,50.55 | 26.16,50.55 26.25,50.55 R7.1
USBD+
  Top 0.254: U$1.45 33.46,50.52 36.29,53.35 38.96,53.35 SV4.14 41.88,56.27 41.88,57.41 42.76,58.29 RN1.3
USBD-
  Top 0.254: U$1.44 33.98,50.02 36.04,52.08 SV4.11 39.85,53.35 41.37,53.35 RN1.4
VCAP_1  (via drill 0.6)
  Top 0.254: SV3.16 33.24,35.06 33.24,36.84 28.87,41.21 U$1.31 28.87,43.31 v28.09,44
  Bottom 0.406: C1.1 28.08,44.1 v28.09,44
VCAP_2  (via drill 0.6)
  Top 0.254: SV4.16 38.96,55.89 37.05,55.89 32.68,51.52 U$1.47 30.29,51.52 29.9,51.07 v29.9,50.52
  Bottom 0.254: C2.1 30.54,51.22 v29.9,50.52

### Text on the board
tPlace: Rodolfo E. Leiva, / Qiyue (Jennifer) Liang, / Xinyi (Erin) Jiang, / Wen Shen (Vincent) Mow | C_IN1 | PURDUE IEEE ROV | +5V | +12V | CAM_LEDV
_tsilk: Application Board